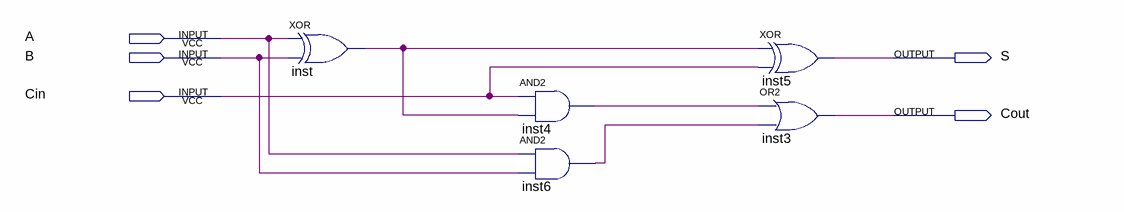
[diagram p0: schematic sheet]
// Quartus schematic Full_Add.bdf as structural Verilog: 5 symbols, 5 pins
module Full_Add (
  input  A,
  input  B,
  input  Cin,
  output S,
  output Cout
);

  wire inst4_out, inst6_out, inst_out;

  xor inst (inst_out, A, B);
  and inst4 (inst4_out, Cin, inst_out);
  and inst6 (inst6_out, A, B);
  xor inst5 (S, inst_out, Cin);
  or inst3 (Cout, inst4_out, inst6_out);
endmodule
